# Altium project SUBBOARD-power_stage.PrjPcb
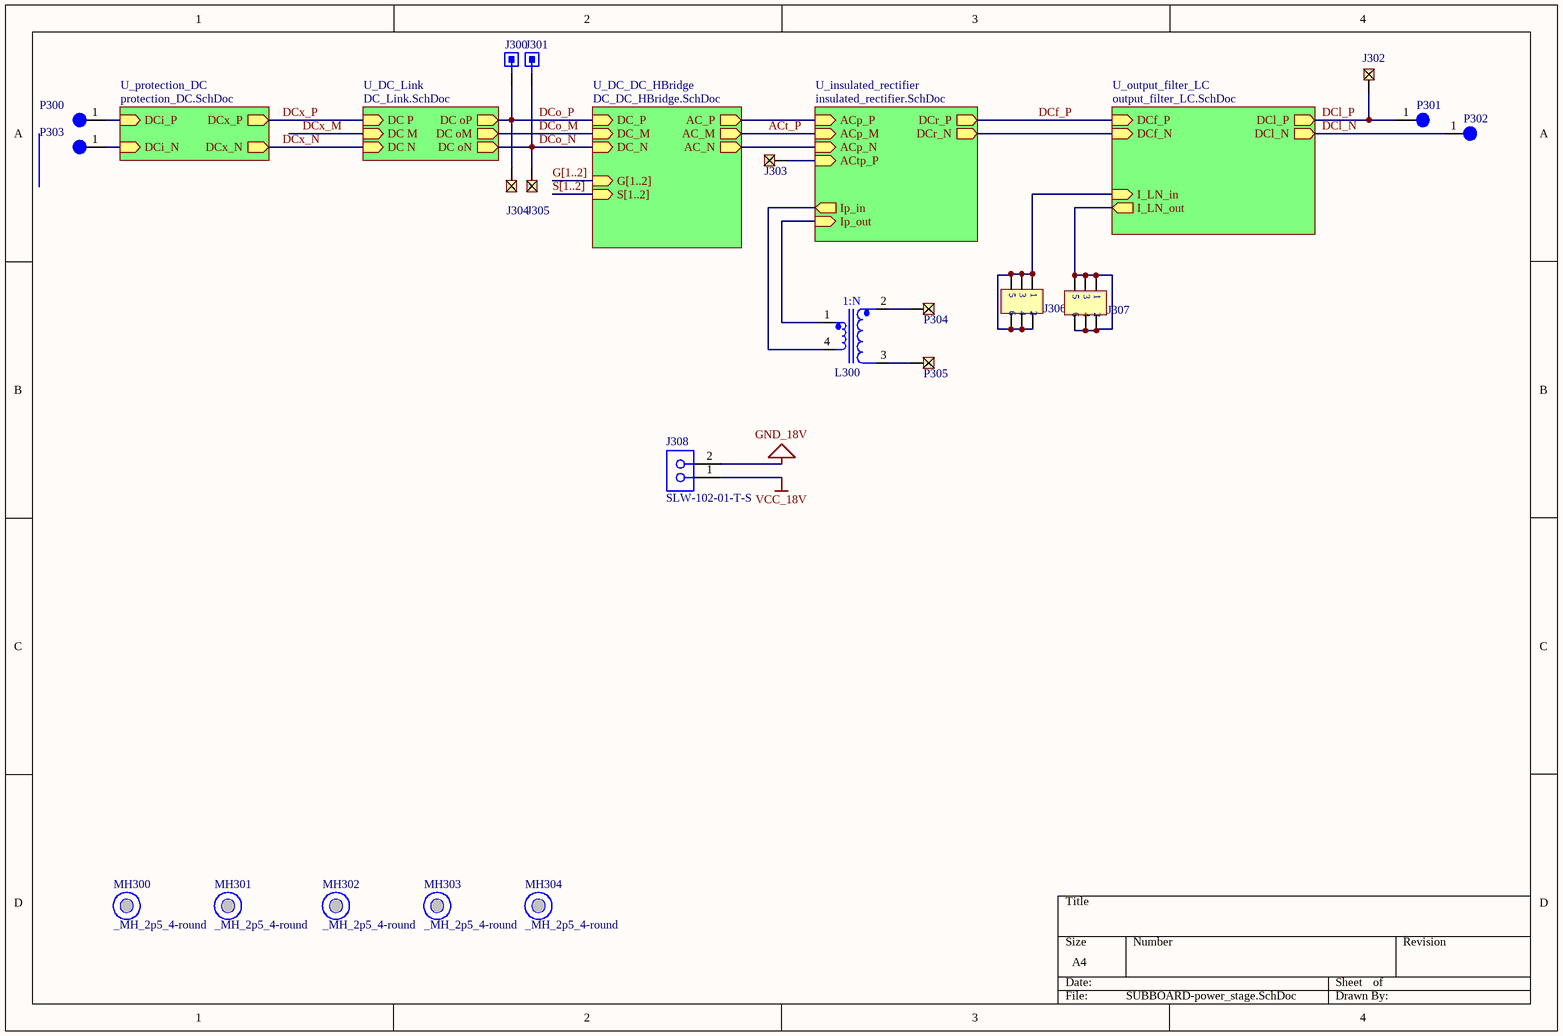
[diagram p0: SUBBOARD-power_stage.SchDoc]
6 sheets, 73 parts. Net scope: hierarchical (ports join the sheet entries above them; power ports are global).
Board file: SUBBOARD-power_stage.PcbDoc
Sheets:
  SUBBOARD-power_stage.SchDoc
    U_DC_Link = DC_Link.SchDoc
    U_insulated_rectifier = insulated_rectifier.SchDoc
    U_protection_DC = protection_DC.SchDoc
    U_DC_DC_HBridge = DC_DC_HBridge.SchDoc
    U_output_filter_LC = output_filter_LC.SchDoc

## Sheet SUBBOARD-power_stage.SchDoc
size A4

### Parts
J300  CES-101-01-T-S  [CES-101-01-T-S]  (value not drawn)
J301  CES-101-01-T-S  [CES-101-01-T-S]  (value not drawn)
J302  SSW-101-01-G-S  [SAM1209-01-ND]  (value not drawn)
J303  SSW-101-01-G-S  [SAM1209-01-ND]  (value not drawn)
J304  SSW-101-01-G-S  [SAM1209-01-ND]  (value not drawn)
J305  SSW-101-01-G-S  [SAM1209-01-ND]  (value not drawn)
J306  SSW-103-01-G-D  [SSW-103-01-G-D]  (value not drawn)
J307  SSW-103-01-G-D  [SSW-103-01-G-D]  (value not drawn)
J308  SLW-102-01-T-S  [SMTC-SLW-102-01-X-S]
L300  PA0368.050NLT  [PA0368.050NLT]  (value not drawn)
MH300  _MH_2p5_4-round  [_MH_2p5_4-round]
MH301  _MH_2p5_4-round  [_MH_2p5_4-round]
MH302  _MH_2p5_4-round  [_MH_2p5_4-round]
MH303  _MH_2p5_4-round  [_MH_2p5_4-round]
MH304  _MH_2p5_4-round  [_MH_2p5_4-round]
P300  Test_Point_1p7  [_TP_1p7]  (value not drawn)
P301  Test_Point_3_4p5_square_vias  [_TP_3_4p5_square_vias]  (value not drawn)
P302  Test_Point_3_4p5_square_vias  [_TP_3_4p5_square_vias]  (value not drawn)
P303  Test_Point_1p7  [_TP_1p7]  (value not drawn)
P304  SSW-101-01-G-S  [SAM1209-01-ND]  (value not drawn)
P305  SSW-101-01-G-S  [SAM1209-01-ND]  (value not drawn)

### Sub-sheets
U_DC_DC_HBridge = DC_DC_HBridge.SchDoc: DC_P (in), DC_M (in), DC_N (in), AC_P (out), AC_N (out), AC_M (out), G[1..2] (in), S[1..2] (in)
U_DC_Link = DC_Link.SchDoc: DC P (in), DC M (in), DC N (in), DC oP (out), DC oM (out), DC oN (out)
U_insulated_rectifier = insulated_rectifier.SchDoc: ACp_P (in), ACp_N (in), DCr_P (out), DCr_N (out), Ip_out (in), Ip_in (out), ACp_M (in), ACtp_P (in)
U_output_filter_LC = output_filter_LC.SchDoc: DCf_N (in), DCl_N (out), DCl_P (out), DCf_P (in), I_LN_in (in), I_LN_out (out)
U_protection_DC = protection_DC.SchDoc: DCx_P (out), DCx_N (out), DCi_P (in), DCi_N (in)

### Nets
GND_18V: J308.2
VCC_18V: J308.1
ACres_N: J303.1 ; sheet U_insulated_rectifier/ACtp_P
ACt_P: L300.4 ; sheet U_insulated_rectifier/Ip_in, sheet U_insulated_rectifier/ACp_M, sheet U_DC_DC_HBridge/AC_M
ACtp_N: L300.1 ; sheet U_insulated_rectifier/Ip_out
ACts_M: J307.1 J307.2 J307.3 J307.4 J307.5 J307.6 ; sheet U_insulated_rectifier/DCr_N, sheet U_output_filter_LC/DCf_N, sheet U_output_filter_LC/I_LN_out
DCf_P: sheet U_insulated_rectifier/DCr_P, sheet U_output_filter_LC/DCf_P
DCin_N: P303.1 ; sheet U_protection_DC/DCi_N
DCin_P: P300.1 ; sheet U_protection_DC/DCi_P
DCl_N: J306.1 J306.2 J306.3 J306.4 J306.5 J306.6 P302.1 ; sheet U_output_filter_LC/DCl_N, sheet U_output_filter_LC/I_LN_in
DCl_P: J302.1 P301.1 ; sheet U_output_filter_LC/DCl_P
DCo_M: sheet U_DC_Link/DC M, sheet U_DC_Link/DC oM, sheet U_DC_DC_HBridge/DC_M  [also labelled DCx_M]
DCo_N: J301.1 J305.1 ; sheet U_DC_Link/DC N, sheet U_DC_Link/DC oN, sheet U_insulated_rectifier/ACp_N, sheet U_protection_DC/DCx_N, sheet U_DC_DC_HBridge/DC_N, sheet U_DC_DC_HBridge/AC_N  [also labelled DCx_N]
DCo_P: J300.1 J304.1 ; sheet U_DC_Link/DC P, sheet U_DC_Link/DC oP, sheet U_insulated_rectifier/ACp_P, sheet U_protection_DC/DCx_P, sheet U_DC_DC_HBridge/DC_P, sheet U_DC_DC_HBridge/AC_P  [also labelled DCx_P]
NetL300_2: L300.2 P304.1
NetL300_3: L300.3 P305.1

### Buses and harness runs
bus G[1..2] = sheet U_DC_DC_HBridge/G[1..2]
bus S[1..2] = sheet U_DC_DC_HBridge/S[1..2]

### Notes on the sheet
- (in symbol PA0368.050NLT) 1:N

### Library data of the parts
J300 J301 = CES-101-01-T-S: Conn Socket Strip SKT 1 POS Solder ST Thru-Hole; Manufacturer: Samtec; Connector Type: Receptacle; Number of Positions: 1; System: Connector; Supplier 1: Digi-Key; Manufacturer Part Number: CES-101-01-T-S; RoHS: Yes; Category: Connectors; Stock 1: 3369; Pricing 1: 1=0.18000, 10=0.16800, 25=0.12520, 50=0.10720, 100=0.10370, 250=0.08940, 500=0.08582 (USD); Mount: Through Hole; Color: Black; Contact Plating: Tin; Contact Material: Bronze; Housing Material: Plastic; Housing Color: Black; Number of Rows: 1; Packaging: Bulk; Termination: Solder; Gender: Receptacle; Number of Contacts: 1; Package Quantity: 1; Length: 2.54mm; Height: 5.08mm; Width: 3.05mm; Radiation Hardening: No; Lead Free: Lead Free; REACH SVHC: No SVHC; ComponentLink1URL: https://datasheet.ciiva.com/413/ces-mkt-413326.pdf?src-supplier=Digi-Key; ComponentLink1Description: https://datasheet.ciiva.com/413/ces-mkt-413326.pdf?src-supplier=Digi-Key; Supplier Part Number 1: SAM1087-01-ND
J302-J305 P304 P305 = SSW-101-01-G-S: CLEAR GLOVE BX 100 M - More Details; Manufacturer: Samtec; Connector Type: Receptacle,Socket; Number of Positions: 1; Gender: Receptacle; Max Current Rating: 6.9A; Max Voltage Rating (AC): 550V; Mating Cycles: 100; Contact Resistance: 10mR; System: Connector; Supplier 1: Digi-Key; Manufacturer Part Number: SSW-101-01-G-S; RoHS: Yes; Category: Connectors; Stock 1: 10228; Pricing 1: 1=0.25000, 10=0.23600, 25=0.20120, 50=0.17600, 100=0.16350, 250=0.14464, 500=0.13834 (USD); Mount: Through Hole; Contact Plating: Gold; Contact Material: Bronze; Color: Black; Housing Material: Polymer; Housing Color: Black; Min Operating Temperature: -55°C; Max Operating Temperature: 125°C; Packaging: Bulk; Termination: Solder; Number of Contacts: 1; Number of Rows: 1; Orientation: Straight; Length: 3.05mm; Width: 2.41mm; Depth: 2.41mm; Radiation Hardening: No; Lead Free: Lead Free; REACH SVHC: No SVHC; ComponentLink1URL: https://datasheet.ciiva.com/749/ssw-1xx-xx-xxx-x-xx-xxx-xx-mkt-749879.pdf?src-supplier=Digi-Key; ComponentLink1Description: https://datasheet.ciiva.com/749/ssw-1xx-xx-xxx-x-xx-xxx-xx-mkt-749879.pdf?src-supplier=Digi-Key; Supplier Part Number 1: SAM1209-01-ND
J306 J307 = SSW-103-01-G-D: Conn Socket Strip SKT 6 POS 2.54mm Solder ST Thru-Hole; Manufacturer: Samtec; Number of Contacts: 6; Gender: Receptacle; Connector Type: Receptacle,Socket; Contact Resistance: 10mR; Max Current Rating: 6.9A; Max Voltage Rating (AC): 550V; Mating Cycles: 100; Row Spacing: 0.1inch; Supplier 1: Digi-Key; Manufacturer Part Number: SSW-103-01-G-D; RoHS: Yes; Category: Headers and Wire Housings; Stock 1: 1397; Pricing 1: 1=0.93000, 10=0.82100, 25=0.77240, 50=0.74020, 100=0.70800, 250=0.64368, 500=0.57932 (USD); Mount: Through Hole; Contact Plating: Gold; Contact Material: Bronze; Color: Black; Housing Color: Black; Housing Material: Polymer; Min Operating Temperature: -55°C; Max Operating Temperature: 125°C; Number of Rows: 2; Termination: Solder; Packaging: Bulk; Number of Positions: 6; Orientation: Vertical; Current Rating: 6.9A; Voltage Rating: 550V; Length: 8.13mm; Pitch: 2.54mm; Depth: 4.95mm; Radiation Hardening: No; Lead Free: Lead Free; REACH SVHC: No SVHC; ComponentLink1URL: https://datasheet.ciiva.com/25617/0900766b8115c03d-25617399.pdf?src-supplier=RSComponents; ComponentLink1Description: https://datasheet.ciiva.com/25617/0900766b8115c03d-25617399.pdf?src-supplier=RSComponents; ComponentLink2URL: https://datasheet.ciiva.com/22677/82032-22677622.pdf?src-supplier=Element14; ComponentLink2Description: https://datasheet.ciiva.com/22677/82032-22677622.pdf?src-supplier=Element14; ComponentLink3URL: https://datasheet.ciiva.com/749/ssw-1xx-xx-xxx-x-xx-xxx-xx-mkt-749828.pdf?src-supplier=Digi-Key; ComponentLink3Description: https://datasheet.ciiva.com/749/ssw-1xx-xx-xxx-x-xx-xxx-xx-mkt-749828.pdf?src-supplier=Digi-Key; Supplier Part Number 1: SAM1208-03-ND
J308 = CMP-1023-00124-1: Low Profile Socket Strips, Through-hole, Vertical, -55 to 105 degC, 2.54 mm Pitch, 2-Pin, Female, RoHS; Manufacturer: Samtec; Pitch: 2.54 mm; System: Connector; ComponentLink2Description: Datasheet; PackageReference: SLW-102-01-X-S; Orientation: Vertical; PartNumber: SLW-102-01-T-S; ComponentLink3URL: http://www.samtec.com/documents/webfiles/cpdf/SLW-1XX-01-X-X-MKT.pdf; DatasheetVersion: F-214; Mounting Technology: Through-hole; ComponentLink3Description: Package Specification; ComponentLink2URL: http://www.samtec.com/documents/webfiles/pdf/SLW.PDF; PackageDescription: Low Profile Socket Strip; Temperature Range: -55 to 105 degC; ComponentLink1Description: Manufacturer URL; PackageVersion: X, 9/1987; RoHS: True; ComponentLink1URL: http://www.samtec.com
L300 = PA0368.050NLT: Current Transformer 1:50 500Vrms 0.004Ohm Prim. DCR 0.9Ohm Sec. DCR 4000mA Surface Mount; Manufacturer: Pulse; Frequency: 1kHz; Current Rating: 4A; Inductance: 1.7mH; DC Resistance (DCR): 4mR; Supplier 1: Digi-Key; Manufacturer Part Number: PA0368.050NLT; RoHS: Yes; Category: Inductors; Stock 1: 2736; Pricing 1: 1=2.28000, 10=1.82200, 25=1.48000, 50=1.44220, 100=1.40420, 250=1.36620, 500=1.35482 (USD); Mount: Surface Mount; Number of Pins: 4; Min Operating Temperature: -40°C; Max Operating Temperature: 130°C; Turns Ratio: 1:50; Packaging: Tape and Reel; Package Quantity: 1100; Termination: SMD/SMT; Length: 8.25mm; Height: 3.4mm; Width: 8.25mm; Height - Seated (Max): 3.4mm; Depth: 8.25mm; Radiation Hardening: No; ComponentLink1URL: https://datasheet.ciiva.com/3293/+spm2007-57-3293304.pdf?src-supplier=Avnet; ComponentLink1Description: https://datasheet.ciiva.com/3293/+spm2007-57-3293304.pdf?src-supplier=Avnet; ComponentLink2URL: https://datasheet.ciiva.com/17293/+spm2007-57-17293503.pdf?src-supplier=Avnet+Europe; ComponentLink2Description: https://datasheet.ciiva.com/17293/+spm2007-57-17293503.pdf?src-supplier=Avnet+Europe; Supplier Part Number 1: 553-3809-1-ND
MH300-MH304 = _MH_2p5_4-round: matching hole 2.5 hole, 4mm pad (round)
P300 P303 = Test_Point_1p7: Test point 1.7mm
P301 P302 = Test_Point_3_4p5_square_vias: Test point 4.5mm hole 3mm square connector with vias

## Sheet DC_Link.SchDoc
size A4
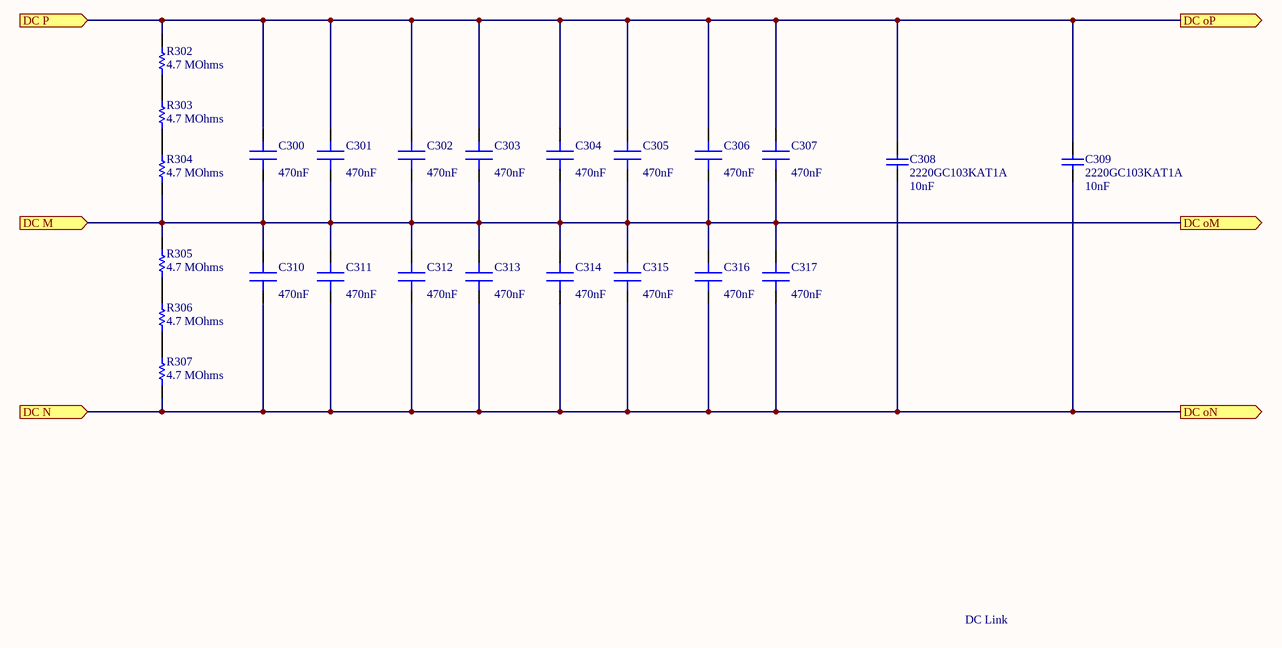
[diagram p1: DC_Link.SchDoc]

### Parts
C300  Capacitance: 470nF  [C_1812_CKG45NX7T2J474M500JH]  (hidden comment: CKG45NX7T2J474M500JH)
C301  Capacitance: 470nF  [C_1812_CKG45NX7T2J474M500JH]  (hidden comment: CKG45NX7T2J474M500JH)
C302  Capacitance: 470nF  [C_1812_CKG45NX7T2J474M500JH]  (hidden comment: CKG45NX7T2J474M500JH)
C303  Capacitance: 470nF  [C_1812_CKG45NX7T2J474M500JH]  (hidden comment: CKG45NX7T2J474M500JH)
C304  Capacitance: 470nF  [C_1812_CKG45NX7T2J474M500JH]  (hidden comment: CKG45NX7T2J474M500JH)
C305  Capacitance: 470nF  [C_1812_CKG45NX7T2J474M500JH]  (hidden comment: CKG45NX7T2J474M500JH)
C306  Capacitance: 470nF  [C_1812_CKG45NX7T2J474M500JH]  (hidden comment: CKG45NX7T2J474M500JH)
C307  Capacitance: 470nF  [C_1812_CKG45NX7T2J474M500JH]  (hidden comment: CKG45NX7T2J474M500JH)
C308  2220GC103KAT1A  Capacitance: 10nF  [CAPC5750X330X64LL40T39]
C309  2220GC103KAT1A  Capacitance: 10nF  [CAPC5750X330X64LL40T39]
C310  Capacitance: 470nF  [C_1812_CKG45NX7T2J474M500JH]  (hidden comment: CKG45NX7T2J474M500JH)
C311  Capacitance: 470nF  [C_1812_CKG45NX7T2J474M500JH]  (hidden comment: CKG45NX7T2J474M500JH)
C312  Capacitance: 470nF  [C_1812_CKG45NX7T2J474M500JH]  (hidden comment: CKG45NX7T2J474M500JH)
C313  Capacitance: 470nF  [C_1812_CKG45NX7T2J474M500JH]  (hidden comment: CKG45NX7T2J474M500JH)
C314  Capacitance: 470nF  [C_1812_CKG45NX7T2J474M500JH]  (hidden comment: CKG45NX7T2J474M500JH)
C315  Capacitance: 470nF  [C_1812_CKG45NX7T2J474M500JH]  (hidden comment: CKG45NX7T2J474M500JH)
C316  Capacitance: 470nF  [C_1812_CKG45NX7T2J474M500JH]  (hidden comment: CKG45NX7T2J474M500JH)
C317  Capacitance: 470nF  [C_1812_CKG45NX7T2J474M500JH]  (hidden comment: CKG45NX7T2J474M500JH)
R302  value 4.7 MOhms  [RESC3216X60X45LL10T20]  (hidden comment: CRCW12064M70FKEA)
R303  value 4.7 MOhms  [RESC3216X60X45LL10T20]  (hidden comment: CRCW12064M70FKEA)
R304  value 4.7 MOhms  [RESC3216X60X45LL10T20]  (hidden comment: CRCW12064M70FKEA)
R305  value 4.7 MOhms  [RESC3216X60X45LL10T20]  (hidden comment: CRCW12064M70FKEA)
R306  value 4.7 MOhms  [RESC3216X60X45LL10T20]  (hidden comment: CRCW12064M70FKEA)
R307  value 4.7 MOhms  [RESC3216X60X45LL10T20]  (hidden comment: CRCW12064M70FKEA)

### Ports
DC M (in), DC N (in), DC oM (out), DC oN (out), DC oP (out), DC P (in)

### Nets
DCo_M: C300.1 C301.1 C302.1 C303.1 C304.1 C305.1 C306.1 C307.1 C310.2 C311.2 C312.2 C313.2 C314.2 C315.2 C316.2 C317.2 R304.2 R305.1 ; port DC M, port DC oM
DCo_N: C308.1 C309.1 C310.1 C311.1 C312.1 C313.1 C314.1 C315.1 C316.1 C317.1 R307.2 ; port DC N, port DC oN
DCo_P: C300.2 C301.2 C302.2 C303.2 C304.2 C305.2 C306.2 C307.2 C308.2 C309.2 R302.1 ; port DC P, port DC oP
NetR302_2: R302.2 R303.1
NetR303_2: R303.2 R304.1
NetR305_2: R305.2 R306.1
NetR306_2: R306.2 R307.1

### Notes on the sheet
- DC Link

### Library data of the parts
C300-C307 C310-C317 = CKG45NX7T2J474M500JH: TDK         CKG45NX7T2J474M500JH             SMD Multilayer Ceramic Capacitor, 1812 [4532 Metric], 0.47 F, 630 V,  20%, X7T, CKG Series; Voltage Rating: 630V; Supplier 1: Digi-Key; Manufacturer: TDK; Manufacturer Part Number: CKG45NX7T2J474M500JH; RoHS: Yes; Category: Ceramic Capacitors; Stock 1: 1650; Pricing 1: 1=4,71000, 10=3,79500, 100=2,96010, 500=2,20110 (USD); Mount: Surface Mount; Case/Package: SMD/SMT; Case Code (Imperial): 1812; Case Code (Metric): 4532; Min Operating Temperature: -55°C; Max Operating Temperature: 125°C; Tolerance: 20%; Packaging: Tape and Reel; Voltage Rating (DC): 630V; Dielectric: X7T; Termination: Metal; Package Quantity: 1; Composition: Ceramic; Length: 5mm; Height: 5mm; Width: 0.138inch; Thickness: 0.217inch; Depth: 3.5mm; REACH SVHC: No SVHC; ComponentLink1URL: https://datasheet.ciiva.com/24221/ckg45nx7t2j474m500jh-24221101.pdf?src-supplier=Mouser; ComponentLink1Description: https://datasheet.ciiva.com/24221/ckg45nx7t2j474m500jh-24221101.pdf?src-supplier=Mouser; ComponentLink2URL: https://datasheet.ciiva.com/6253/mlcc-commercial-megacap-en-6253704.pdf?src-supplier=Digi-Key; ComponentLink2Description: https://datasheet.ciiva.com/6253/mlcc-commercial-megacap-en-6253704.pdf?src-supplier=Digi-Key; ComponentLink3URL: https://datasheet.ciiva.com/6253/mlcc-commercial-megacap-en-6253702.pdf?src-supplier=Digi-Key; ComponentLink3Description: https://datasheet.ciiva.com/6253/mlcc-commercial-megacap-en-6253702.pdf?src-supplier=Digi-Key; Supplier Part Number 1: 445-7101-1-ND
C308 C309 = CMP-2000-05534-1: Chip Capacitor, 10000 pF, +/- 10%, 2000 V, -55 to 125 degC, 2220 (5750 Metric), RoHS, Tape and Reel; Manufacturer: AVX; Dielectric: X7R; Rated Voltage: 2000V; Datasheet URL: http://datasheets.avx.com/HighVoltageAutoMLCC.pdf; Case Size/Dimension: 2220; Manufacturer URL: http://www.avx.com/; Mounting Technology: SurfaceMount; Package Reference: 2220; Datasheet Version: 06/2016; Tolerance (%): ±10%; Package Description: 2-Pin Surface Mount Device, Body 5.7 x 5 mm
R302-R307 = CMP-2003-02243-1: Manufacturer: Vishay Dale; Part Number: CRCW12064M70FKEA; Package: 1206

## Sheet insulated_rectifier.SchDoc
size A4
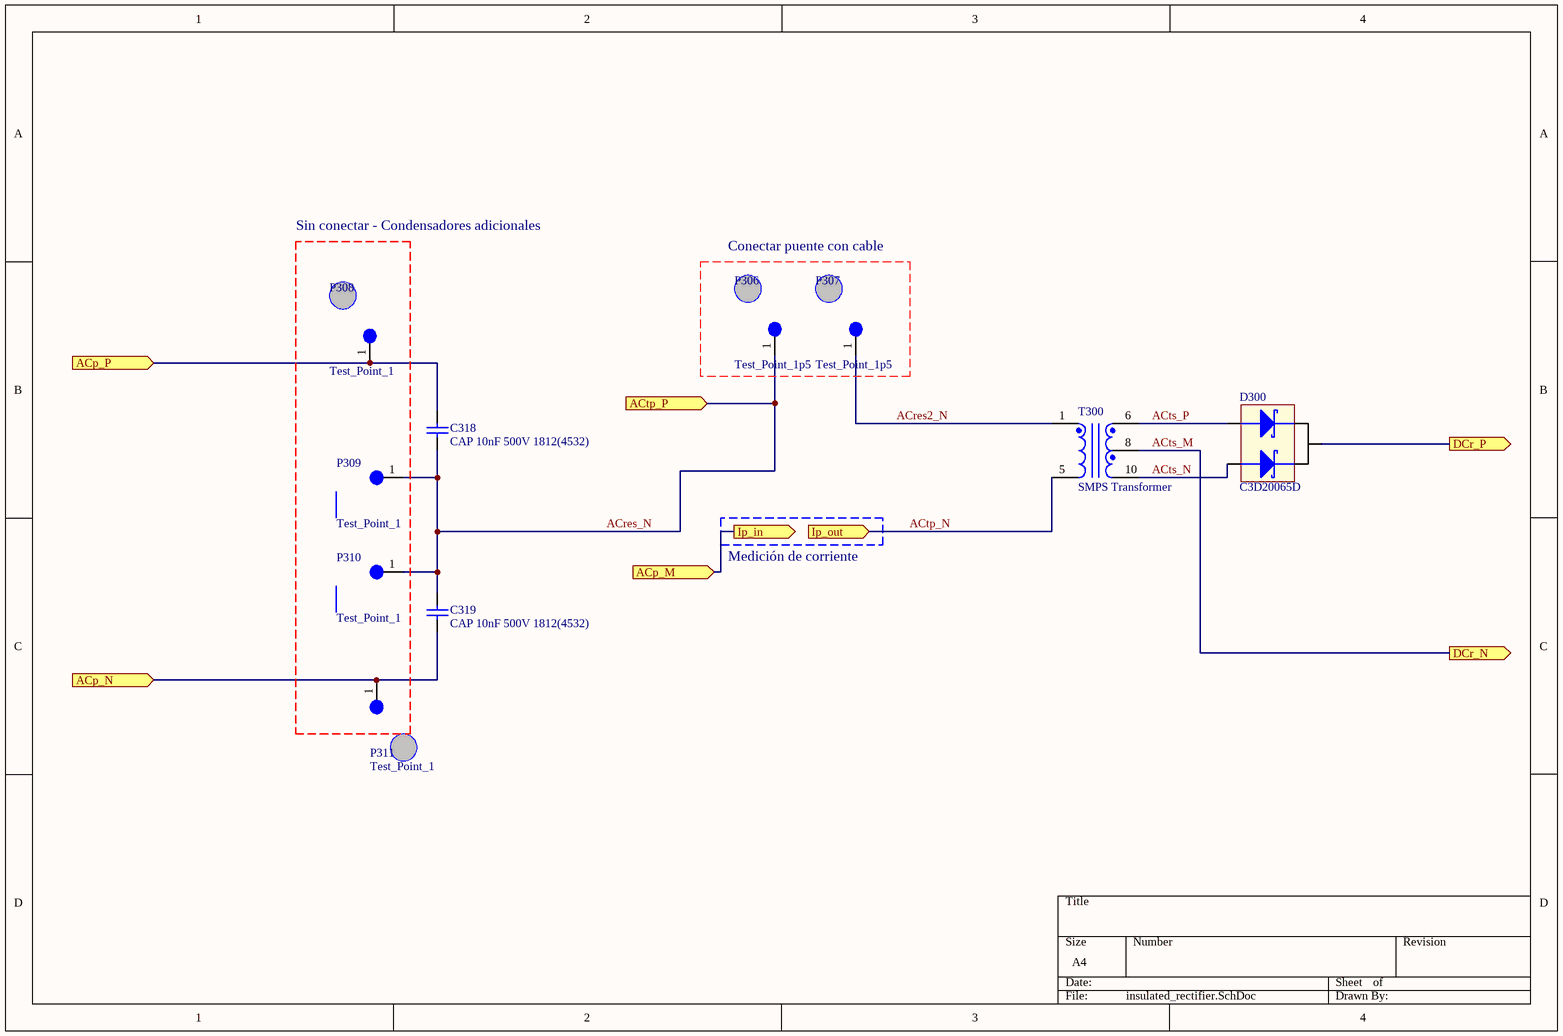
[diagram p2: insulated_rectifier.SchDoc]

### Parts
C318  CAP 10nF 500V 1812(4532)  [CAPC1812(4532)230_M]
C319  CAP 10nF 500V 1812(4532)  [CAPC1812(4532)230_M]
D300  C3D20065D  [TO-247-3_hsa]
P306  Test_Point_1p5  [_TP_1p5]
P307  Test_Point_1p5  [_TP_1p5]
P308  Test_Point_1  [_TP_1mm]
P309  Test_Point_1  [_TP_1mm]
P310  Test_Point_1  [_TP_1mm]
P311  Test_Point_1  [_TP_1mm]
T300  SMPS Transformer  [Payton_SMPS_trafo_61446]

### Blocks framed on the sheet
Sin conectar - Condensadores adicionales: P308-P311

### Ports
ACp_M (in), ACp_N (in), ACp_P (in), ACtp_P (in), DCr_N (out), DCr_P (out), Ip_in (out), Ip_out (in)

### Nets
ACres2_N: P307.1 T300.1
ACres_N: C318.1 C319.2 P306.1 P309.1 P310.1 ; port ACtp_P
ACt_P: port Ip_in, port ACp_M
ACtp_N: T300.5 ; port Ip_out
ACts_M: T300.8 ; port DCr_N
ACts_N: D300.3 T300.10
ACts_P: D300.1 T300.6
DCf_P: D300.2 ; port DCr_P
DCo_N: C319.1 P311.1 ; port ACp_N
DCo_P: C318.2 P308.1 ; port ACp_P

### Notes on the sheet
- Conectar puente con cable
- Medición de corriente

### Library data of the parts
C318 C319 = CMP-1040-00850-1: CAP 10nF 500V ±10% 1812 (4532 Metric) Thickness 2.3mm SMD; Case-EIA: 1812; Tolerance: Â±10%; Case-Metric: 4532; Max Thickness: 2.3 mm; Rated Voltage: 500 V; Technology: SMT; Value: 10nF
D300 = C3D20065D: Schottky Diodes & Rectifiers Schottky Diode 2X10A, 650V C3D20065D; Manufacturer: Cree; Element Configuration: Common Cathode; Forward Current: 55A; Supplier 2: Digi-Key; Manufacturer Part Number: C3D20065D; RoHS: Yes; Category: Rectifier Diodes; Stock 2: 143; Pricing 2: 1=10,17000, 100=8,47000, 500=7,26004, 1000=6,36001 (USD); Case/Package: TO-247; Number of Pins: 3; Max Repetitive Reverse Voltage (Vrrm): 650V; Packaging: Cut Tape; REACH SVHC: No SVHC; ComponentLink1URL: http://www.mouser.com/ds/2/90/3d20065d_silicon_carbide_schottky_diode_z_rec_rect-838556.pdf?src-supplier=Mouser; ComponentLink1Description: http://www.mouser.com/ds/2/90/3d20065d_silicon_carbide_schottky_diode_z_rec_rect-838556.pdf?src-supplier=Mouser; ComponentLink2URL: http://www.farnell.com/datasheets/1821848.pdf?src-supplier=Element14; ComponentLink2Description: http://www.farnell.com/datasheets/1821848.pdf?src-supplier=Element14; ComponentLink3URL: http://www.wolfspeed.com/media/downloads/102/C3D20065D.pdf?src-supplier=Digi-Key; ComponentLink3Description: http://www.wolfspeed.com/media/downloads/102/C3D20065D.pdf?src-supplier=Digi-Key; Supplier Part Number 2: C3D20065D-ND; Supplier 1: Mouser; Stock 1: 7; Pricing 1: 1 = 10.17000, 100 = 8.47000, 500 = 7.26000, 1000 = 6.36000 (USD); ComponentLink4URL: https://www.wolfspeed.com/downloads/dl/file/id/102/product/74/c3d20065d.pdf?src-supplier=Digi-Key; ComponentLink4Description: https://www.wolfspeed.com/downloads/dl/file/id/102/product/74/c3d20065d.pdf?src-supplier=Digi-Key; Supplier Part Number 1: 941-C3D20065D
P306 P307 = Test_Point_1p5: Test point 1.5mm
P308-P311 = Test_Point_1: Test point 1mm
T300 = Payton_SMPS_trafo_61446: 1400W SMPS Transformer Payton 61446; Generic Type: T250AC-24-18C; Total Output Power (after rectifier): 1400W (140 Vdc/ 10 Adc); Transformer Operating Frequency: 150 kHz; Topology: Half Bridge; Input Voltage: 750-1000 Vdc; Transformer Input Voltage: 374-499 Vdc; Operating duty cicle, max.: 1 (0,5*2); Operating Volt-second product, max.: 2500 (1250*2) V-usec.; Primary Current, max.: 4,07 Arms (4,2 Apeak); Pri. to half Sec. ratio (Sec current, max. - 7,07 Arms): 24:9; Dielectric Strength (Pri. to Sec.): 2000 Vrms; Dielectric Strength (Pri.+Sec. to Core): 500 Vdc; Estimated Power Losses: 15W; Estimated Hot Spot Temperature (With heatsink of 85°C max attached): 110 °C; Ambient Temperature Range: - 40 °C to 85°C; Mechanical Dimension - Length (For reference only): 67 mm.; Mechanical Dimension - Width (For reference only): 65 mm.; Mechanical Dimension - Height (For reference only): 32 mm.

## Sheet protection_DC.SchDoc
size A4
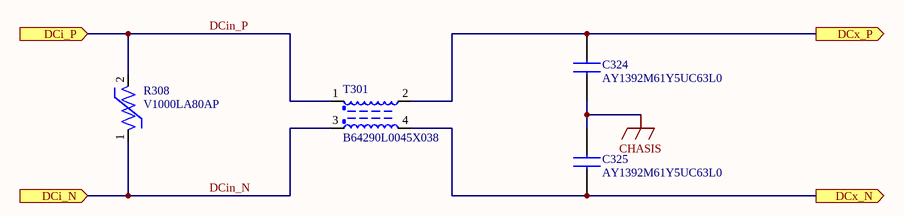
[diagram p3: protection_DC.SchDoc]

### Parts
C324  AY1392M61Y5UC63L0  [AY1392M61Y5UC63L0]
C325  AY1392M61Y5UC63L0  [AY1392M61Y5UC63L0]
R308  V1000LA80AP  [V1000LA80AP]
T301  B64290L0045X038  [B64290L0045X038]

### Ports
DCi_N (in), DCi_P (in), DCx_N (out), DCx_P (out)

### Nets
CHASIS: C324.2 C325.1
DCin_N: R308.1 T301.3 ; port DCi_N
DCin_P: R308.2 T301.1 ; port DCi_P
DCo_N: C325.2 T301.4 ; port DCx_N
DCo_P: C324.1 T301.2 ; port DCx_P

### Library data of the parts
C324 C325 = AY1392M61Y5UC63L0: Cap Ceramic 0.0039uF 1500V Y5U 20% Through Hole 10mm Radial 125°C Bulk; Manufacturer: Vishay; Value: 3.9 nF; Manufacturer Part Number: AY1392M61Y5UC63L0; Stock 1: 472; Pricing 1: 1=0,81000, 10=0,61800, 100=0,44180, 500=0,34200, 1000=0,29450, 2500=0,27550, 5000=0,26125 (USD); Supplier 1: Digi-Key; Supplier 2: Farnell; Supplier 3: Newark; Supplier Part Number 3: 95AC5614; Supplier Part Number 2: 2987310; Supplier Part Number 1: BC5432-ND
R308 = V1000LA80AP: Varistors 1000V 130pF; Manufacturer: Littelfuse; Max Voltage Rating (AC): 1kV; Max Voltage Rating (DC): 1.2kV; Number of Circuits: 1; Energy: 220J; Max Surge Current: 4.5kA; Min Varistor Voltage: 1.5kV; Varistor Voltage: 1.8kV; Clamping Voltage: 2.7kV; Clamping Current: 50A; Lead/Base Style: Radial; Manufacturer Part Number: V1000LA80AP; RoHS: Yes; Category: Varistors; Stock 1: 1833; Pricing 1: 1=2,50000, 10=2,26200, 25=2,02000, 100=1,81800, 250=1,61600, 500=1,41400, 1000=1,17160, 2500=1,09080, 5000=1,05040 (USD); Mount: Through Hole,Radial; Min Operating Temperature: -55°C; Max Operating Temperature: 85°C; Packaging: Bulk; Max Varistor Voltage: 1.8kV; Termination: Radial; Package Quantity: 300; Voltage Rating: 1.2kV; Voltage Rating (DC): 1.2kV; Voltage Rating (AC): 1kV; Capacitance: 130pF; Max Output Current: 4.5kA; Current Rating: 4.5kA; Diameter: 14mm; Depth: 10.8mm; Thickness: 10.8mm; Width: 10.8mm; Lead Pitch: 8.5mm; REACH SVHC: Unknown; Lead Free: Lead Free; ComponentLink1URL: https://datasheet.ciiva.com/25604/0900766b81107157-25604568.pdf?src-supplier=RSComponents; ComponentLink1Description: https://datasheet.ciiva.com/25604/0900766b81107157-25604568.pdf?src-supplier=RSComponents; ComponentLink2URL: https://datasheet.ciiva.com/366/littelfuse-mov-la-366032.pdf?src-supplier=Digi-Key; ComponentLink2Description: https://datasheet.ciiva.com/366/littelfuse-mov-la-366032.pdf?src-supplier=Digi-Key; ComponentLink3URL: https://datasheet.ciiva.com/15155/getdatasheetpartid-97401-15155450.pdf?src-supplier=Verical; ComponentLink3Description: https://datasheet.ciiva.com/15155/getdatasheetpartid-97401-15155450.pdf?src-supplier=Verical; ComponentLink4URL: https://datasheet.ciiva.com/16379/la-16379084.pdf?src-supplier=Future+Electronics; ComponentLink4Description: https://datasheet.ciiva.com/16379/la-16379084.pdf?src-supplier=Future+Electronics; ComponentLink5URL: https://datasheet.ciiva.com/8070/482376-8070941.pdf?src-supplier=Element14; ComponentLink5Description: https://datasheet.ciiva.com/8070/482376-8070941.pdf?src-supplier=Element14; ComponentLink6URL: https://datasheet.ciiva.com/4540/littelfuse-mov-la-34212-4540703.pdf?src-supplier=Mouser; ComponentLink6Description: https://datasheet.ciiva.com/4540/littelfuse-mov-la-34212-4540703.pdf?src-supplier=Mouser; Supplier 1: Digi-Key; Supplier 2: Arrow; Supplier 3: Future Electronics; Supplier 4: Mouser; Supplier 5: Farnell; Supplier 6: Newark; Supplier 7: Newark; Supplier Part Number 7: 58K7189; Supplier Part Number 6: 80R8723; Supplier Part Number 5: 1816971; Supplier Part Number 4: 576-V1000LA80AP; Supplier Part Number 3: V1000LA80AP-BOX; Supplier Part Number 1: F3029-ND; Supplier Part Number 2: V1000LA80AP
T301 = B64290L0045X038: FERRITE CORE TOROID 6.44UH T38; Manufacturer: TDK; Shape: Cylindrical; Manufacturer Part Number: B64290L0045X038; RoHS: Yes; Category: Uncategorized; Stock 1: 6794; Pricing 1: 1=0,79000, 10=0,71000, 25=0,52600, 50=0,49980, 100=0,44710, 250=0,42080, 500=0,39450, 1000=0,34190, 5000=0,32875 (USD); Package Quantity: 2000; Packaging: Bulk; Diameter: 17.2mm; ComponentLink1URL: http://components.arrow.com/part/dataview/0323_01888516?src-supplier=Arrow+Europe; ComponentLink1Description: http://components.arrow.com/part/dataview/0323_01888516?src-supplier=Arrow+Europe; ComponentLink2URL: https://www.verical.com/server-webapp/html/getDatasheet?partID=477647&src-supplier=Verical; ComponentLink2Description: https://www.verical.com/server-webapp/html/getDatasheet?partID=477647&src-supplier=Verical; ComponentLink3URL: http://www.epcos.com/inf/80/db/fer_07/r_16.pdf?src-supplier=Avnet; ComponentLink3Description: http://www.epcos.com/inf/80/db/fer_07/r_16.pdf?src-supplier=Avnet; ComponentLink4URL: https://en.tdk.eu/download/531586/2d679ff7e70f74dfb98dc2a4732cca7b/pdf-toroids-general-information.pdf?src-supplier=Digi-Key; ComponentLink4Description: https://en.tdk.eu/download/531586/2d679ff7e70f74dfb98dc2a4732cca7b/pdf-toroids-general-information.pdf?src-supplier=Digi-Key; Supplier 1: Digi-Key; Supplier 2: Arrow; Supplier 3: Farnell; Supplier 4: Newark; Supplier Part Number 4: 02AC3431; Supplier Part Number 3: 2673401; Supplier Part Number 2: B64290L0045X038; Supplier Part Number 1: 495-3854-ND

## Sheet DC_DC_HBridge.SchDoc
size A4
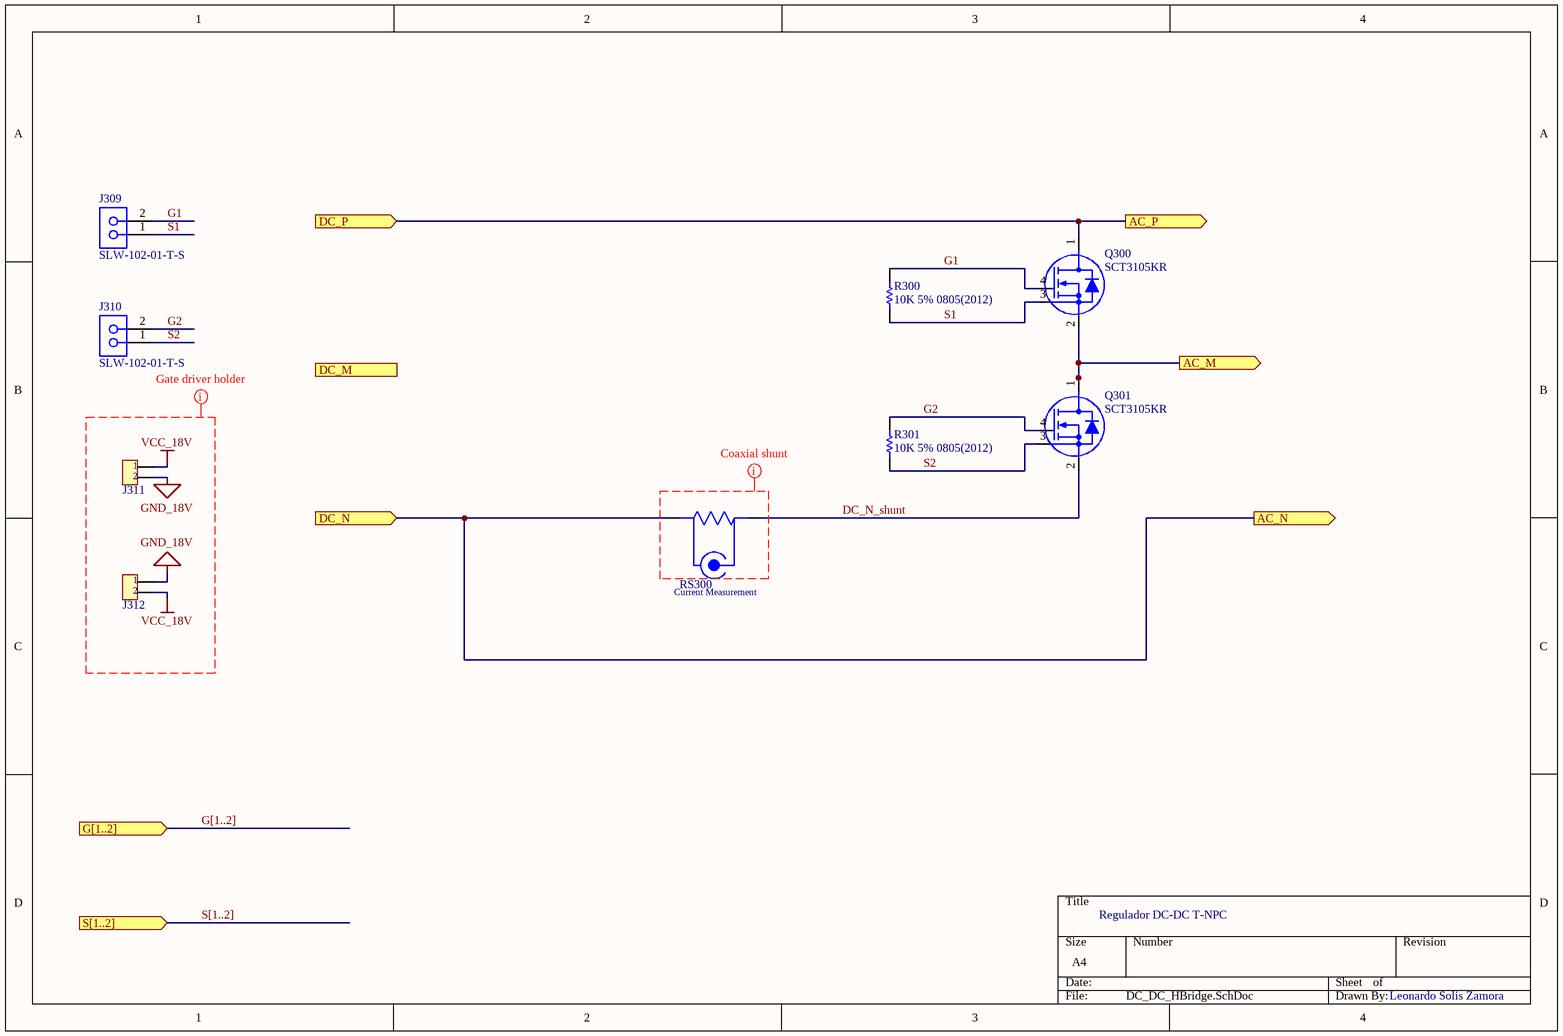
[diagram p4: DC_DC_HBridge.SchDoc]

### Parts
J309  SLW-102-01-T-S  [SMTC-SLW-102-01-X-S]
J310  SLW-102-01-T-S  [SMTC-SLW-102-01-X-S]
J311  SSM-102-L-SV  [SSM-102-L-SV]  (value not drawn)
J312  SSM-102-L-SV  [SSM-102-L-SV]  (value not drawn)
Q300  SCT3105KR  [TO-247-4L_hsa]
Q301  SCT3105KR  [TO-247-4L_hsa]
R300  10K 5% 0805(2012)  [RESC0805(2012)_L]
R301  10K 5% 0805(2012)  [RESC0805(2012)_L]
RS300  SDN-414  [SDN-414]  (value not drawn)

### Ports
AC_M (out), AC_N (out), AC_P (out), DC_M (in), DC_N (in), DC_P (in), G[1..2] (in), S[1..2] (in)

### Nets
GND_18V: J311.2 J312.1
VCC_18V: J311.1 J312.2
ACt_P: Q300.2(S) Q301.1(D) ; port AC_M
DC_N_shunt: Q301.2(S) RS300.2(+)
DCo_N: RS300.1(-) ; port DC_N, port AC_N
DCo_P: Q300.1(D) ; port DC_P, port AC_P
G1: J309.2 Q300.4(G) R300.1
G2: J310.2 Q301.4(G) R301.1
S1: J309.1 Q300.3(KS) R300.2
S2: J310.1 Q301.3(KS) R301.2

### Buses and harness runs
bus G[1..2] = port G[1..2]
bus S[1..2] = port S[1..2]

### Layout directives
mark named Coaxial shunt: (no net found under the mark)
mark named Gate driver holder: GND_18V, VCC_18V

### Notes on the sheet
- Current Measurement
- Regulador DC-DC T-NPC
- Leonardo Solis Zamora

### Library data of the parts
J309 J310 = CMP-1023-00124-1: as J308 on sheet SUBBOARD-power_stage; ComponentLink2Description: Datasheet; PackageReference: SLW-102-01-X-S; Orientation: Vertical; PartNumber: SLW-102-01-T-S; ComponentLink3URL: http://www.samtec.com/documents/webfiles/cpdf/SLW-1XX-01-X-X-MKT.pdf; DatasheetVersion: F-214; Mounting Technology: Through-hole; ComponentLink3Description: Package Specification; ComponentLink2URL: http://www.samtec.com/documents/webfiles/pdf/SLW.PDF; PackageDescription: Low Profile Socket Strip; Temperature Range: -55 to 105 degC; ComponentLink1Description: Manufacturer URL; PackageVersion: X, 9/1987; RoHS: True; ComponentLink1URL: http://www.samtec.com
J311 J312 = SSM-102-L-SV: SAMTEC - SSM-102-L-SV - RECEPTACLE, 2.54MM, VERT, 2WAY; Number of Contacts: 2; Contact Resistance: 10mR; Max Voltage Rating (AC): 475V; Max Current Rating: 6.9A; Connector Type: Receptacle,Socket; Supplier 1: Digi-Key; Manufacturer: Samtec; Manufacturer Part Number: SSM-102-L-SV; RoHS: Yes; Category: Headers and Wire Housings; Stock 1: 51; Pricing 1: 1=0.56000, 10=0.52100, 25=0.46920, 50=0.41700, 100=0.39960, 250=0.36488, 500=0.34752 (USD); Mount: Surface Mount; Contact Plating: Gold; Contact Material: Bronze; Housing Material: Polymer; Housing Color: Black; Color: Black; Min Operating Temperature: -55°C; Max Operating Temperature: 125°C; Termination: Solder; Number of Rows: 1; Packaging: Bulk; Gender: Receptacle; Orientation: Straight; Current Rating: 6.9A; Number of Positions: 2; Voltage Rating: 475V; Voltage Rating (AC): 475V; Length: 5.08mm; Pitch: 2.54mm; Depth: 2.54mm; Lead Pitch: 2.54mm; Radiation Hardening: No; Lead Free: Lead Free; REACH SVHC: No SVHC; ComponentLink1URL: https://datasheet.ciiva.com/25617/0900766b811594ab-25617394.pdf?src-supplier=RSComponents; ComponentLink1Description: https://datasheet.ciiva.com/25617/0900766b811594ab-25617394.pdf?src-supplier=RSComponents; ComponentLink2URL: https://datasheet.ciiva.com/746/ssm-1xx-xxx-xx-xx-xx-x-xx-xx-mkt-746741.pdf?src-supplier=Digi-Key; ComponentLink2Description: https://datasheet.ciiva.com/746/ssm-1xx-xxx-xx-xx-xx-x-xx-xx-mkt-746741.pdf?src-supplier=Digi-Key; ComponentLink3URL: https://datasheet.ciiva.com/22677/81944-22677814.pdf?src-supplier=Element14; ComponentLink3Description: https://datasheet.ciiva.com/22677/81944-22677814.pdf?src-supplier=Element14; Supplier Part Number 1: SAM1148-02-ND
Q300 Q301 = SCT3105KR: N-channel SiC power MOSFET ROHM. Vdss 1200V, Rdson 105mOhm, Id 24A; Rds on @ Id, Vgs: 137 mOhm; Drive Voltage: 18 V; Gate Charge (Qg) (Max) @ Vds: 51 nC; Vgs Max: +22 V / -4 V; Input Capacitance (Ciss) (Max) @ Vds: 574pF @ 800V; Supplier 1: Mouser; Supplier 2: Digi-Key; Supplier 3: Farnell; Supplier 4: Newark; Supplier Part Number 4: 34AH2699; Supplier Part Number 3: 3241766; Supplier Part Number 2: 846-SCT3105KRC14-ND; Supplier Part Number 1: 755-SCT3105KRC14; FET type: N-Channel; Technology: SiC-FET; Drain-to-source voltage (Vdss): 1200 V; Current - continuous drain (Id) @ 25°C: 24 A; Package/Case: TO-247-4
R300 R301 = CMP-1013-00098-1: 10K 0.125W 5% 0805 (2012 Metric)  SMD; Case-EIA: 0805; Case-Metric: 2012; Value: 10000.00 Ohm; Power: 0.125 W; Technology: SMT; Tolerance: 5 %
RS300 = SDN-414: Coaxial current shunt SDN-414 T&M (New); Manufacturer: Ohmite; Manufacturer Part Number: WHE10RFET; Resistance: 10R; Power Rating: 5W; Tolerance: 1%; Temperature Coefficient: 50ppm/°C; Lead Diameter: 1mm; Supplier 1: Digi-Key; RoHS: Yes; Category: Through-Hole Resistors; Stock 1: 228; Pricing 1: 1=1.54000, 10=1.36400, 25=1.25400, 50=1.14400, 100=0.99000, 250=0.83600 (USD); Case/Package: Axial; Number of Pins: 2; Weight: 0.080848oz; Min Operating Temperature: -55°C; Max Operating Temperature: 150°C; Number of Terminations: 2; Termination: Axial; Package Quantity: 500; Packaging: Tape and Reel; Composition: Wirewound; Max Power Dissipation: 5W; Diameter: 7.5mm; Length: 20mm; REACH SVHC: Unknown; ComponentLink1URL: https://datasheet.ciiva.com/5635/res-wh-wn-5635598.pdf?src-supplier=Mouser; ComponentLink1Description: https://datasheet.ciiva.com/5635/res-wh-wn-5635598.pdf?src-supplier=Mouser; ComponentLink2URL: https://datasheet.ciiva.com/6495/res-wh-wn-6495224.pdf?src-supplier=Digi-Key; ComponentLink2Description: https://datasheet.ciiva.com/6495/res-wh-wn-6495224.pdf?src-supplier=Digi-Key; ComponentLink3URL: https://datasheet.ciiva.com/6495/res-wh-wn-6495226.pdf?src-supplier=Digi-Key; ComponentLink3Description: https://datasheet.ciiva.com/6495/res-wh-wn-6495226.pdf?src-supplier=Digi-Key; Supplier Part Number 1: WHE10RFETCT-ND

## Sheet output_filter_LC.SchDoc
size A4
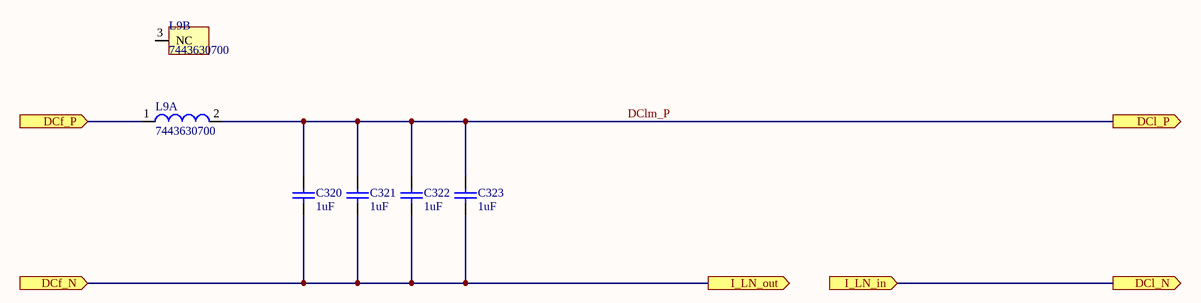
[diagram p5: output_filter_LC.SchDoc]

### Parts
C320  value 1uF  [CAPC2225(5664)230_L]  (hidden comment: CAP 1uF 200V 2225(5664))
C321  value 1uF  [CAPC2225(5664)230_L]  (hidden comment: CAP 1uF 200V 2225(5664))
C322  value 1uF  [CAPC2225(5664)230_L]  (hidden comment: CAP 1uF 200V 2225(5664))
C323  value 1uF  [CAPC2225(5664)230_L]  (hidden comment: CAP 1uF 200V 2225(5664))
L9  7443630700  [WE-HCF-2013]  (parts A,B of 2)

### Ports
DCf_N (in), DCf_P (in), DCl_N (out), DCl_P (out), I_LN_in (in), I_LN_out (out)

### Nets
ACts_M: C320.1 C321.1 C322.1 C323.1 ; port DCf_N, port I_LN_out
DCf_P: L9.1 ; port DCf_P
DCl_N: port DCl_N, port I_LN_in
DClm_P: C320.2 C321.2 C322.2 C323.2 L9.2 ; port DCl_P  [project net DCl_P]

Not connected (* = marked no-connect by the designer): L9 3(NC)

### Library data of the parts
C320-C323 = CMP-1043-00930-1: CAP 1uF 200V ±10% 2225 (5664 Metric) Thickness 2.2mm SMD; Case-EIA: 2225; Tolerance: Â±10%; Case-Metric: 5664; Max Thickness: 2.2 mm; Rated Voltage: 200 V; Technology: SMT
L9 = CMP-0226-00161-1: SMD High Current Inductor WE-HCF, L=7.00 µH; Inductance: 7.00 ÂµH; ComponentLink1URL: http://www.we-online.com; PackageDescription: SMD Inductor, 3-Leads, Body 21.5 x 21.0 mm; ComponentLink1Description: Manufacturer Link; ComponentLink2Description: Datasheet; DatasheetVersion: ver 1, Jul-2009; PackageReference: WE-HCF-2013; PackageVersion: 2009; ComponentLink2URL: http://www.we-online.de/katalog/media/pdf/7443630700.pdf

## Nets that join several sheets
GND_18V: SUBBOARD-power_stage (J308.2), DC_DC_HBridge (J311.2 J312.1)
VCC_18V: SUBBOARD-power_stage (J308.1), DC_DC_HBridge (J311.1 J312.2)
ACres_N: SUBBOARD-power_stage (J303.1), insulated_rectifier (5 pins)
ACt_P: SUBBOARD-power_stage (L300.4), DC_DC_HBridge (Q300.2 Q301.1)
ACtp_N: SUBBOARD-power_stage (L300.1), insulated_rectifier (T300.5)
ACts_M: SUBBOARD-power_stage (6 pins), insulated_rectifier (T300.8), output_filter_LC (C320.1 C321.1 C322.1 C323.1)
DCf_P: insulated_rectifier (D300.2), output_filter_LC (L9.1)
DCin_N: SUBBOARD-power_stage (P303.1), protection_DC (R308.1 T301.3)
DCin_P: SUBBOARD-power_stage (P300.1), protection_DC (R308.2 T301.1)
DCl_P: SUBBOARD-power_stage (J302.1 P301.1), output_filter_LC (5 pins)
DCo_N: SUBBOARD-power_stage (J301.1 J305.1), DC_Link (11 pins), insulated_rectifier (C319.1 P311.1), protection_DC (C325.2 T301.4), DC_DC_HBridge (RS300.1)
DCo_P: SUBBOARD-power_stage (J300.1 J304.1), DC_Link (11 pins), insulated_rectifier (C318.2 P308.1), protection_DC (C324.1 T301.2), DC_DC_HBridge (Q300.1)